# EAGLE design DropBeacon-v1.0.0-Rev-D (EAGLE 6.4)
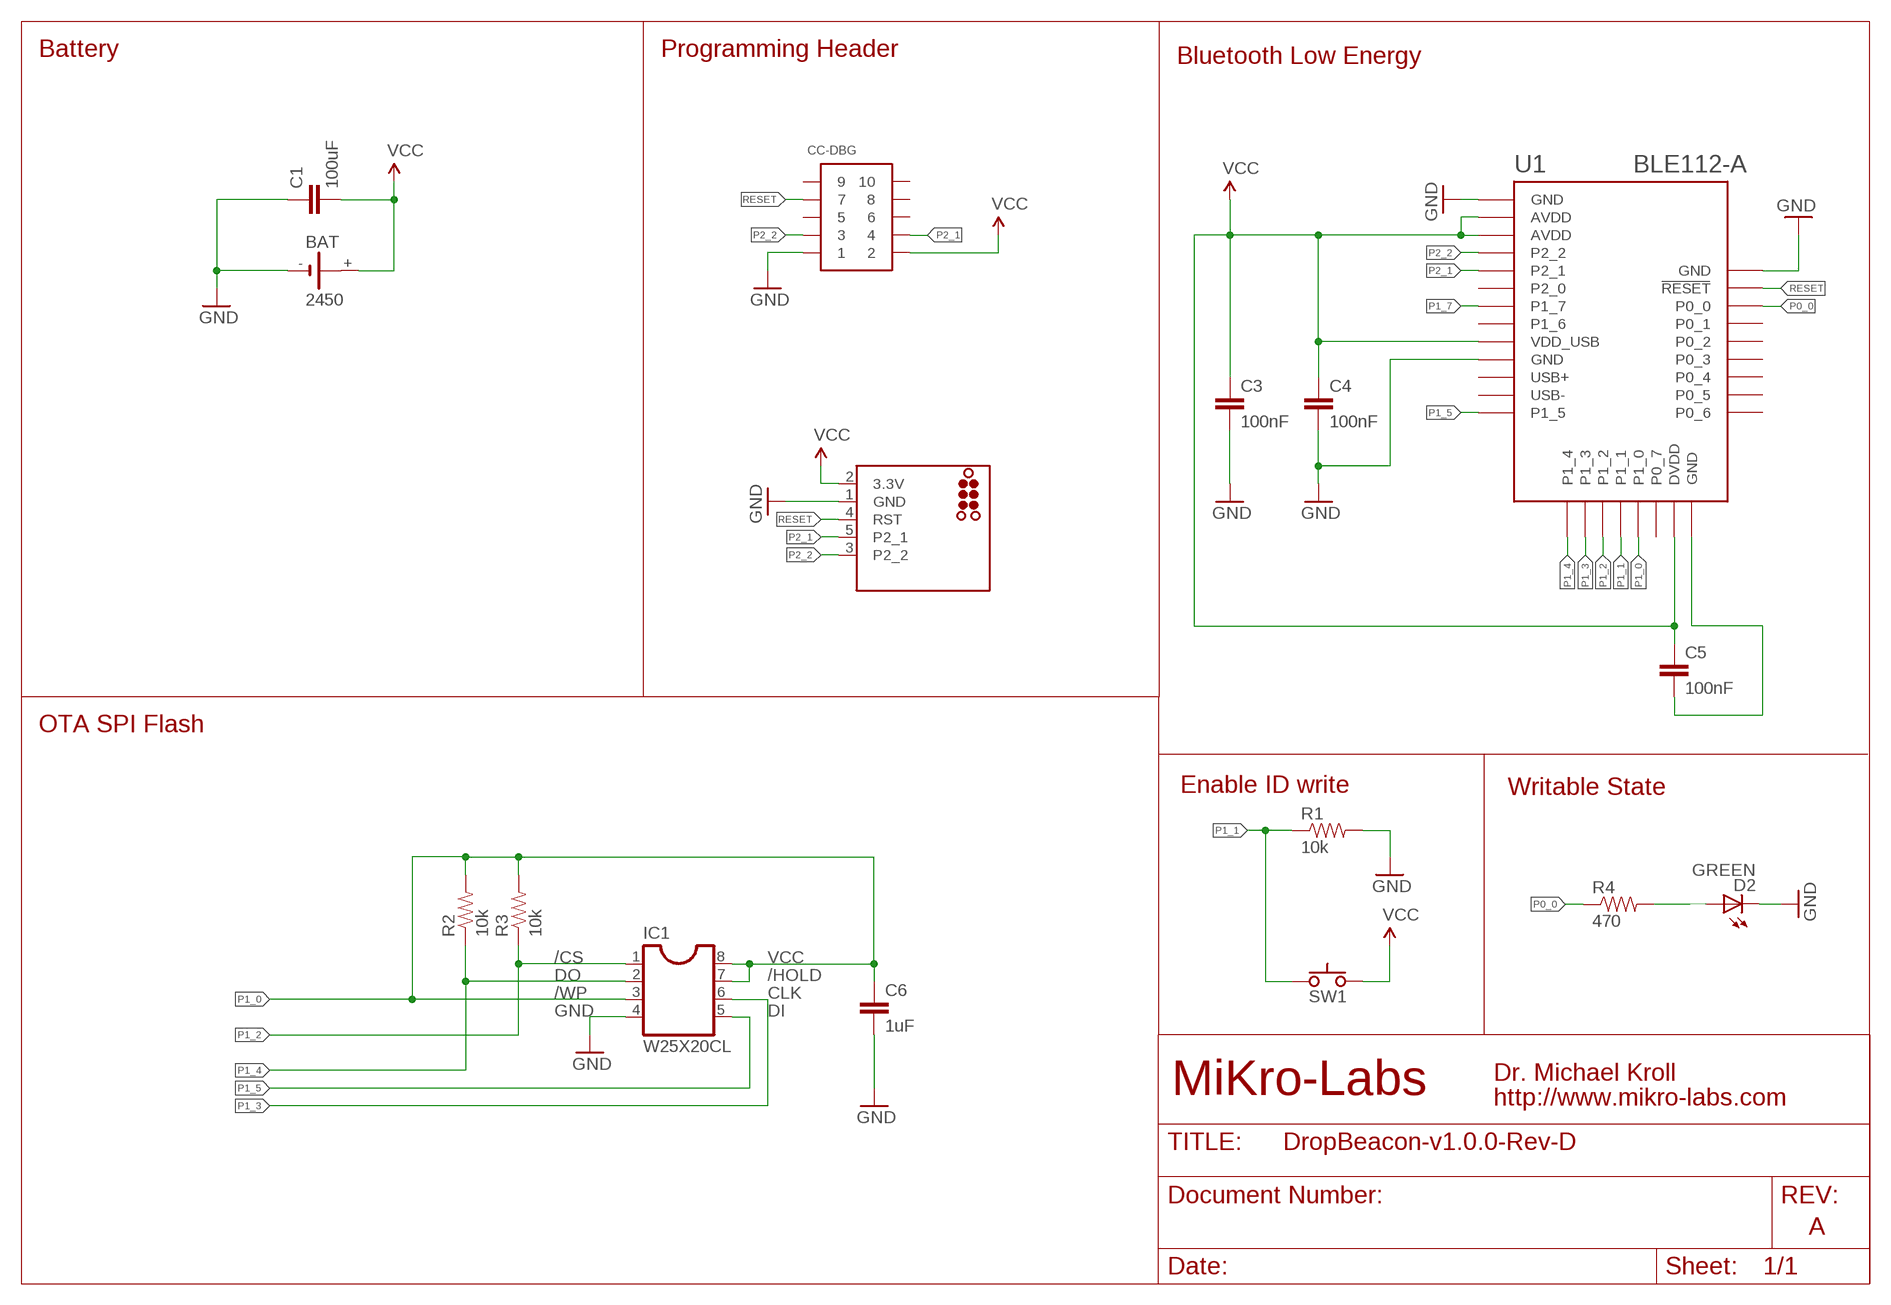
[diagram p0: schematic, sheet 1]

## Parts
BAT  2450  [KZH24SMD]
C1  100uF  CAP1206  [1206]
C3  100nF  CAP0603-CAP  [0603-CAP]
C4  100nF  CAP0603-CAP  [0603-CAP]
C5  100nF  CAP0603-CAP  [0603-CAP]
C6  1uF  CAP0603-CAP  [0603-CAP]
CC-DBG  CONN_5-2-FTSH-V  [FTSH-105-DV]
CC-DEBUGGER  TC2030-CC-DEBUGGER  [TC2030-MCP-NL]
D2  GREEN  LED-GREEN0603  [LED-0603]
IC1  W25X20CL  IC_DIL8-SOIC8  [SO-8]
R1  10k  RESISTOR0603-RES  [0603-RES]
R2  10k  RESISTOR0603-RES  [0603-RES]
R3  10k  RESISTOR0603-RES  [0603-RES]
R4  470  RESISTOR0603-RES  [0603-RES]
SW1  B3U-1000P  [B3U-1000P]
U1  BLE112-A  BLE112-A-VISUAL  [BLE112-A]

## Nets
GND: BAT.- C1.1 C3.2 C4.2 C6.2 CC-DBG.1 CC-DEBUGGER.1(GND) D2.C IC1.4 R1.2 U1.GND U1.GND@2(GND) U1.GND@4(GND)
N$5: D2.A R4.2
N$11: C5.2 U1.GND@3(GND)
P0_0: R4.1 U1.P0_0
P1_0: C6.1 IC1.3 IC1.7 IC1.8 R2.2 R3.2 U1.P1_0
P1_1: R1.1 SW1.1 U1.P1_1
P1_2: IC1.1 R3.1 U1.P1_2
P1_3: IC1.6 U1.P1_3
P1_4: IC1.2 R2.1 U1.P1_4
P1_5: IC1.5 U1.P1_5
P1_7: U1.P1_7
P2_1: CC-DBG.4 CC-DEBUGGER.5(P2_1) U1.P2_1
P2_2: CC-DBG.3 CC-DEBUGGER.3(P2_2) U1.P2_2
RESET: CC-DBG.7 CC-DEBUGGER.4(RST) U1.RESET
VCC: BAT.+ C1.2 C3.1 C4.1 C5.1 CC-DBG.2 CC-DEBUGGER.2(3.3V) SW1.2 U1.AVDD U1.AVDD@2(AVDD) U1.DVDD U1.VDD_USB
Unconnected: CC-DBG.5 CC-DBG.6 CC-DBG.8 CC-DBG.9 CC-DBG.10 U1.P0_1 U1.P0_2 U1.P0_3 U1.P0_4 U1.P0_5 U1.P0_6 U1.P0_7 U1.P1_6 U1.P2_0 U1.USB+ U1.USB-

## Notes on the sheet
- Battery | Programming Header | Bluetooth Low Energy
- OTA SPI Flash
- Enable ID write | Writable State
- /CS | VCC
- DO | /HOLD
- /WP | CLK
- GND | DI
- Dr. Michael Kroll
- MiKro-Labs
- http://www.mikro-labs.com
- A

## Library data of the parts
BAT = SMTU-2032-1:2450
C1 C3-C6 = SparkFun-Capacitors:CAP: Capacitor Standard 0603 ceramic capacitor, and 0.1" leaded capacitor.
CC-DBG = pel_misc:CONN_5-2
CC-DEBUGGER = Tag-Connect:TC2030-CC-DEBUGGER: Arduino TAG-CONNECT ICSP Connector Manufacturer: Tag-Connect <http://www.tag-connect.com> Cable for easy Arduino In-Circuit Bootloader and Sketch Programming. PAD Description 1 MISO 2 VCC 3 SCK 4 MOSI 5 RST 6 GND ©2013 http://www.mkroll.mobi - modified and updated by Dr. Michael Kroll ‹dr.michael.kroll@gmail.com›
D2 = SparkFun-LED:LED-GREEN: Various green LEDs 0603- DIO-00821 LARGE- DIO-00862 LILYPAD- DIO-09910; PROD_ID: DIO-00821
IC1 = dp_devices:IC_DIL8: Universal 8pins IC
R1-R4 = SparkFun-Resistors:RESISTOR: Resistor Basic schematic elements and footprints for 0603, 1206, and PTH resistors.
SW1 = switch-omron:B3U-1000P: Tactile switch Top actuated, without ground terminal, without boss.
U1 = sf-bluegiga:BLE112-A-VISUAL: Bluetooth Low Energy single-mode module - Bluetooth 4.0, chip antenna

## Board
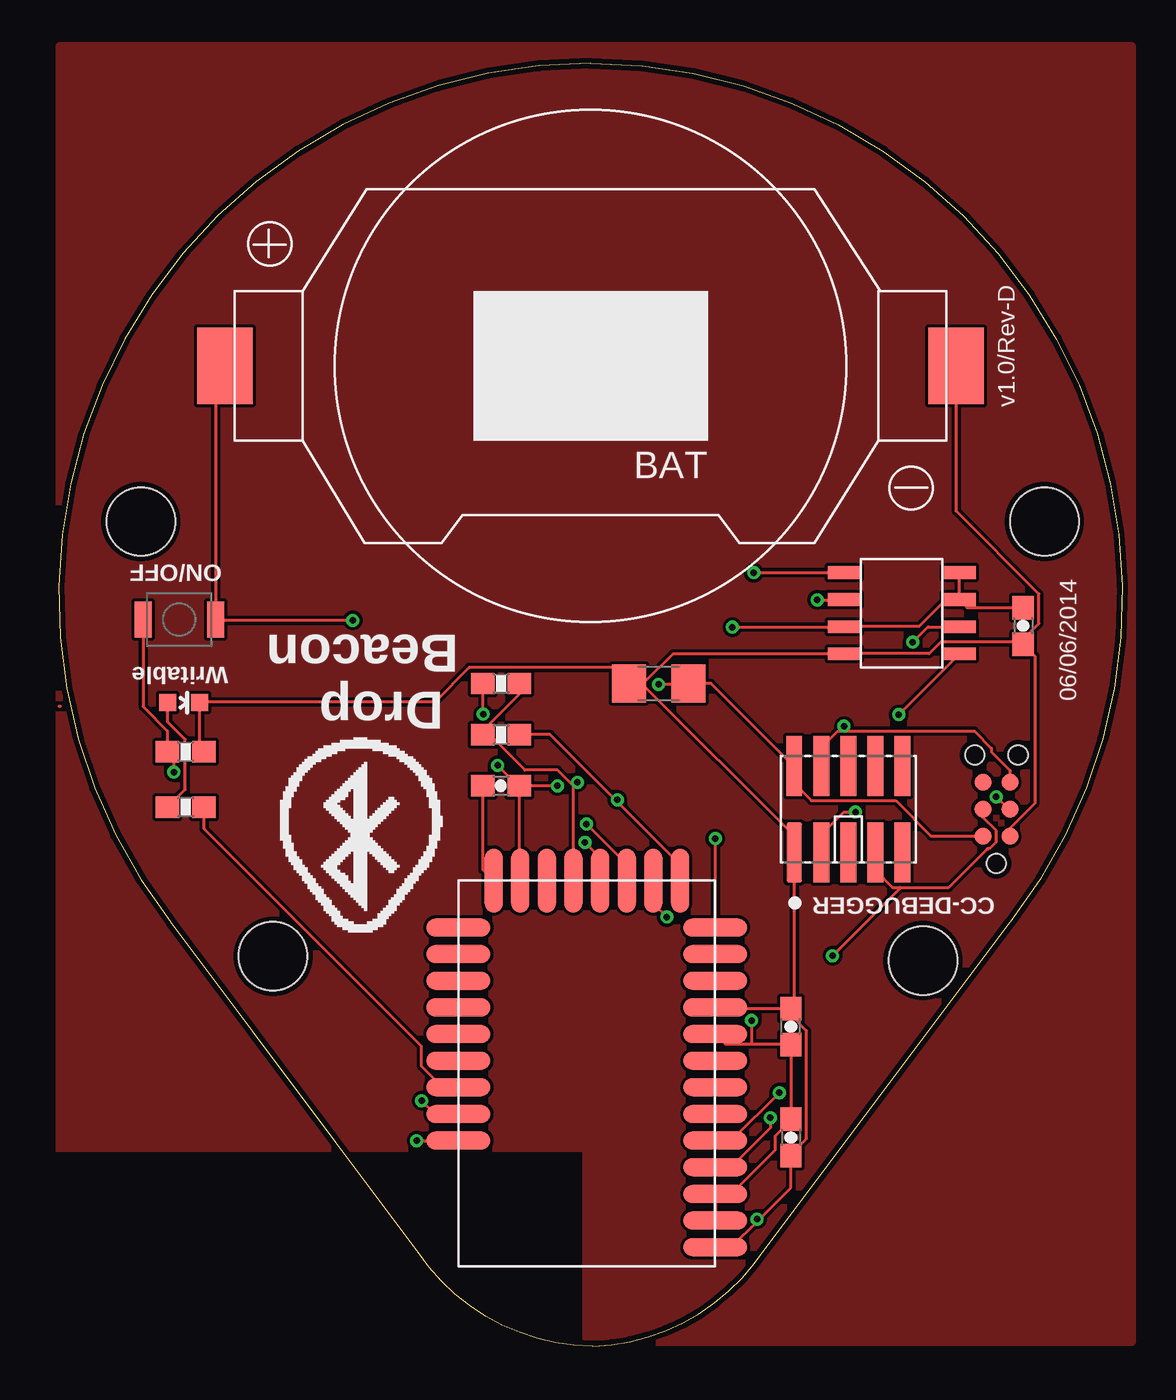
[diagram p1: board, top side]
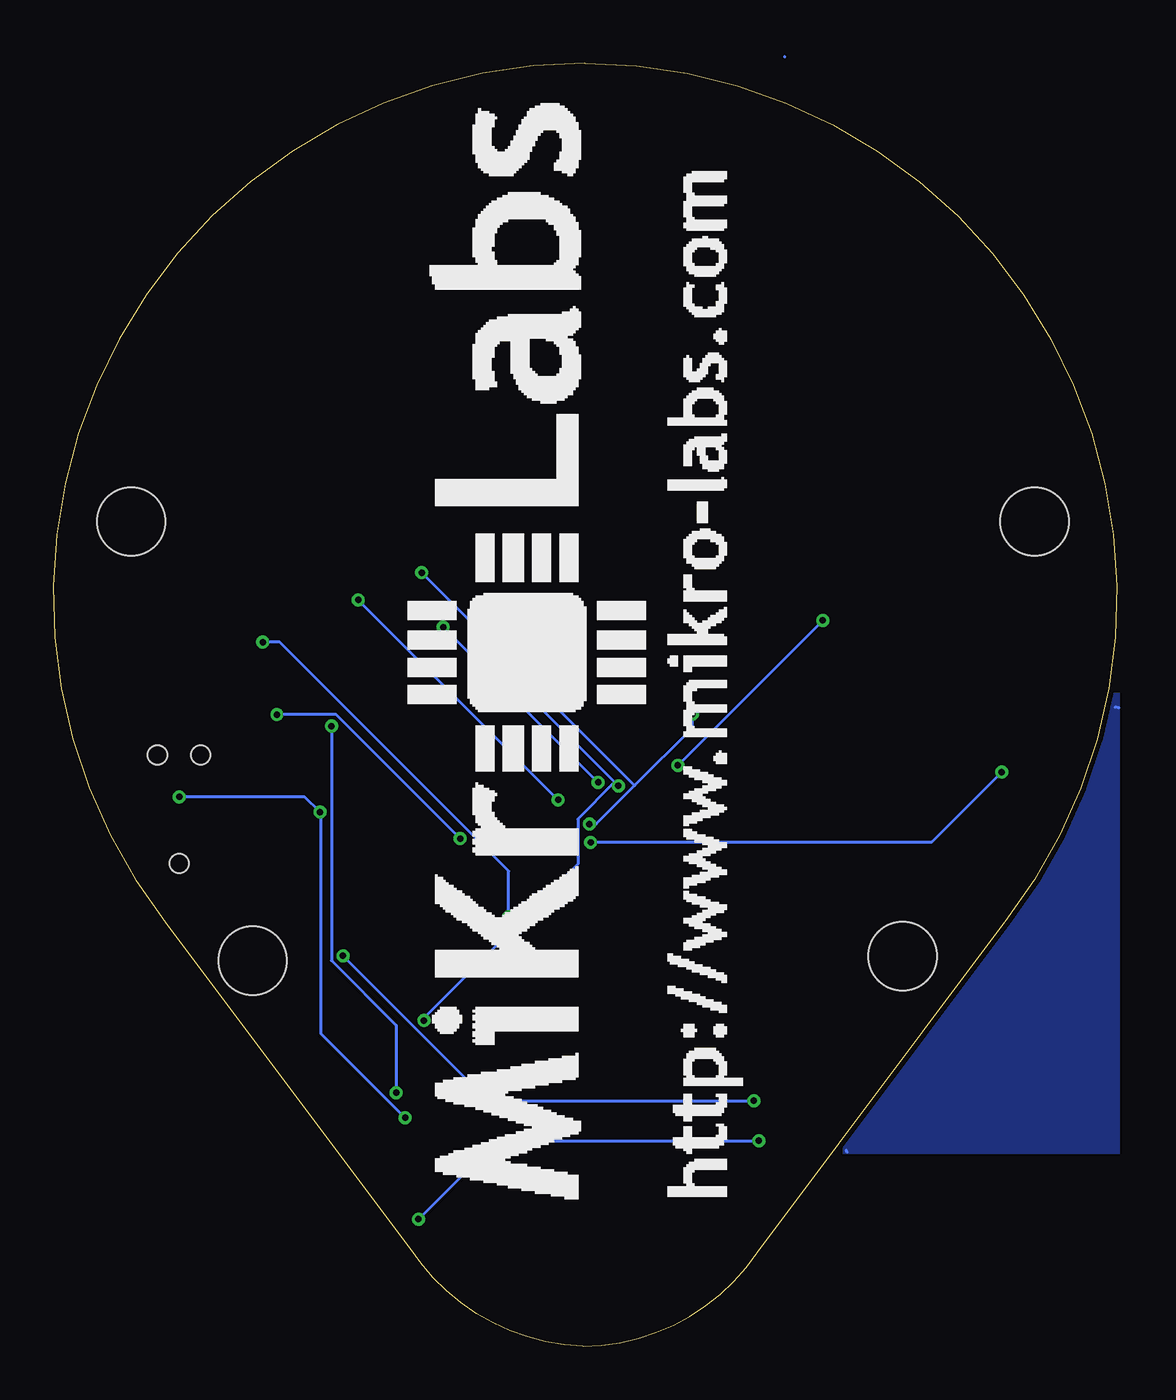
[diagram p2: board, bottom side, seen from below]

Size 49.91 x 60.2 mm. Coordinates in mm from the lower left corner, seen from the top.
Outline: 24.95,60.2 arc128 5.25,19.9 16.85,4.4 arc55 25.05,0 arc55 33.15,4.6 44.65,19.9 arc128 24.95,60.2
Copper layers (1*2*15*16): Top 0.035mm / dielectric 0.2mm / layer 2 0.0175mm / dielectric 1.1mm / layer 15 0.0175mm / dielectric 0.2mm / Bottom 0.035mm
Design rules "SeeedStudio_DRU_no_angle_20130527": minimum track width 6mil, minimum drill 12mil, track to track 6mil, track to pad 6mil, pad to pad 6mil, via to via 6mil, smd to smd 0mil, copper to edge 10mil, drill to drill 10mil, minimum pad ring 6mil, minimum via ring 6mil, stop-mask expansion 2mil, vias tented up to drill 25mil, thermal gap 10mil
Holes 3.2 mm at 46.25,38.7 10.05,18.3 3.85,38.7 40.55,18.1
tRestrict: area 0.1,0.1 to 24.6,9.1
bRestrict: area 0,0.2 to 24.7,9

### Footprints (pad centres in the part's own frame; a part is rotated, then mirrored left to right if it is on the bottom)
KZH24SMD = smd 2.6 x 3.6: + 17.15,0; - -17.15,0
1206 = smd 1.6 x 1.8: 1 -1.4,0; 2 1.4,0
0603-CAP = smd 1.1 x 1: 1 -0.85,0; 2 0.85,0
FTSH-105-DV = smd 0.74 x 2.8: 1 -2.54,-2.03; 2 -2.54,2.03; 3 -1.27,-2.03; 4 -1.27,2.03; 5 0,-2.03; 6 0,2.03; 7 1.27,-2.03; 8 1.27,2.03; 9 2.54,-2.03; 10 2.54,2.03
TC2030-MCP-NL = smd 0.787 x 0.787: 1 1.27,-0.635; 2 1.27,0.635; 3 2.54,-0.635; 4 2.54,0.635; 5 3.81,-0.635; 6 3.81,0.635 | hole 0.889: 0,0; 5.08,-1.016; 5.08,1.016
LED-0603 = smd 0.8 x 0.8: A 0,-0.75; C 0,0.75
SO-8 = smd 0.6 x 1.55: 1 -1.905,-2.69; 2 -0.635,-2.69; 3 0.635,-2.69; 4 1.905,-2.69; 5 1.905,2.71; 6 0.635,2.71; 7 -0.635,2.71; 8 -1.905,2.71
0603-RES = smd 1.1 x 1: 1 -0.85,0; 2 0.85,0
B3U-1000P = smd 0.8 x 1.7: 1 -1.7,0; 2 1.7,0
BLE112-A = smd 3 x 0.85: AVDD -6.05,6.9; AVDD@2 -6.05,5.65; GND -6.05,8.15; GND@2 -6.05,-3.1; GND@4 6,3.15; P0_0 6,0.65; P0_1 6,-0.6; P0_2 6,-1.85; P0_3 6,-3.1; P0_4 6,-4.35; P0_5 6,-5.6; P0_6 6,-6.85; P1_5 -6.05,-6.85; P1_6 -6.05,-0.6; P1_7 -6.05,0.65; P2_0 -6.05,1.9; P2_1 -6.05,3.15; P2_2 -6.05,4.4; RESET 6,1.9; USB+ -6.05,-4.35; USB- -6.05,-5.6; VDD_USB -6.05,-1.85 | smd 0.85 x 3: DVDD 3.1,-9.05; GND@3 4.35,-9.05; P0_7 1.85,-9.05; P1_0 0.6,-9.05; P1_1 -0.65,-9.05; P1_2 -1.9,-9.05; P1_3 -3.15,-9.05; P1_4 -4.4,-9.05

### Placement (x,y rotation side)
BAT  24.95,46 180 top
C1  28.15,31.1 0 top
C3  34.35,15 90 top
C4  34.35,9.8 270 top
C5  20.75,26.3 180 top
C6  45.25,33.8 270 top
CC-DBG  37.05,25.2 0 top
CC-DEBUGGER  44,22.66 90 top
D2  5.85,30.2 270 top
IC1  39.55,34.4 270 top
R1  5.95,27.9 0 top
R2  20.75,28.7 180 top
R3  20.75,31.1 0 top
R4  5.95,25.3 180 top
SW1  5.65,34.1 0 top
U1  24.75,12.8 180 top
U$1  [MIKROLABS-LOGO-LARGE]  20.25,4.3 90 bottom
U$2  [MIKROLABS-URL]  16.45,5.8 90 bottom
U$3  [DROPBEACON-MINI]  17.95,28.5 180 top

### Tracks (layer width: path | path; a pad name or v marks a point on that pad's centre or on a via)
BOTTOM
  Bottom 0.152: 15.59,60.52 15.59,60.5
GND  (via drill 0.3)
  Top 0.152: C3.2 30.85,15.86 U1.GND@2 | C3.2 34.39,15.92 34.51,16.04 CC-DBG.1 34.49,23.24 34.49,23.96 27.37,31.08 C1.1 | 32.82,5.91 31.57,4.66 U1.GND | 32.82,5.91 34.35,7.44 C4.2 34.37,9.02 35.09,9.74 35.09,14.8 34.37,15.52 34.37,15.78 C3.2 | v16.79,9.64 U1.GND@4 | v32.77,5.96 32.82,5.91 | R1.2 6.61,28.08 D2.C 6.67,30.24 17.65,30.24 19.25,31.84 26.01,31.84 C1.1 | CC-DEBUGGER.1 44.65,24.32 45.81,25.48 45.81,32.38 C6.2 | C6.2 45.19,32.98 45.13,33.04 41.39,33.04 40.85,32.5 IC1.4 36.79,32.48 28.81,32.48 27.47,31.14 26.81,31.14 C1.1 | BAT.- 42.11,39.18 45.99,35.3 45.99,33.92 45.17,33.1 C6.2
  Bottom 0.152: v16.79,9.64 29.09,9.64 v32.77,5.96
N$1
  Bottom 0.152: 12.65,9.12 12.69,9.2 | -0.11,29.96 0.08,30
  pour Bottom: 0.05,0.2 50.25,0.2 50.25,60.9 0.05,60.9
N$2
  pour Top: 0.05,0.2 50.35,0.2 50.35,61 0.05,61
N$5
  Top 0.152: D2.A 5.11,29.3 5.93,28.48 5.93,26.12 R4.2
N$11
  Top 0.152: U1.GND@3 19.91,22.34 C5.2
P0_0
  Top 0.152: R4.1 6.81,24.28 17.01,14.08 17.01,13.14 17.99,12.16 U1.P0_0
P1_0  (via drill 0.3)
  Top 0.152: C6.1 42.63,34.66 42.27,35.02 IC1.7 | IC1.7 42.19,35.02 41.61,35.02 40.37,33.78 IC1.3 36.79,33.74 v31.61,33.74 | IC1.8 42.27,35.1 IC1.7 | R3.2 21.59,30.58 19.91,28.9 R2.2 19.97,28.66 20.25,28.66 21.87,27.04 23.41,27.04 24.15,26.3 | U1.P1_0 24.15,26.3 | v24.33,26.46 24.21,26.34 24.15,26.3
  Bottom 0.152: v24.33,26.46 v31.61,33.74
P1_1  (via drill 0.3)
  Top 0.152: SW1.1 3.95,30.02 5.09,28.88 R1.1 5.13,27.84 5.39,27.58 v5.39,26.94 | v24.69,23.64 25.39,22.94 U1.P1_1
  Bottom 0.152: v24.69,23.64 8.69,23.64 v5.39,26.94
P1_2  (via drill 0.3)
  Top 0.152: v19.91,29.66 R3.1 | v24.75,24.5 26.65,22.6 U1.P1_2 | v32.61,36.3 IC1.1
  Bottom 0.152: v19.91,29.66 19.91,29.02 22.62,26.31 | 22.62,26.31 24.43,24.5 v24.75,24.5 | 22.62,26.31 v32.61,36.3
P1_3  (via drill 0.3)
  Top 0.152: v40.07,33.04 40.79,33.76 IC1.6 | v28.53,20.14 27.91,20.76 U1.P1_3
  Bottom 0.152: v40.07,33.04 39.27,33.04 28.53,22.3 v28.53,20.14
P1_4  (via drill 0.3)
  Top 0.152: R2.1 23.05,28.7 26.16,25.59 | 26.16,25.59 29.15,22.6 U1.P1_4 | v35.59,35.02 36.85,35.02 IC1.2 | v26.21,25.64 26.16,25.59
  Bottom 0.152: v26.21,25.64 v35.59,35.02
P1_5  (via drill 0.3)
  Top 0.152: v39.41,29.64 42.25,32.48 IC1.5 | v30.81,23.82 U1.P1_5
  Bottom 0.152: v39.41,29.64 36.63,29.64 v30.81,23.82
P2_1  (via drill 0.3)
  Top 0.152: 36.85,28.86 36.57,28.86 35.79,28.08 CC-DBG.4 | 36.85,28.86 42.97,28.86 43.77,28.06 43.77,27.88 44.63,27.02 CC-DEBUGGER.5 | v33.81,11.9 31.57,9.66 U1.P2_1 | 36.85,28.86 v36.85,29.1
  Bottom 0.152: v33.81,11.9 33.81,15.06 36.85,18.1 v36.85,29.1
P2_2  (via drill 0.3)
  Top 0.152: CC-DEBUGGER.3 44.57,25.2 v43.99,25.78 | v37.39,25.06 36.83,25.06 35.79,24.02 CC-DBG.3 | U1.P2_2 31.55,8.4 33.39,10.24 v33.39,10.72
  Bottom 0.152: v43.99,25.78 38.11,25.78 v37.39,25.06 37.35,25 37.35,14.68 v33.39,10.72
RESET  (via drill 0.3)
  Top 0.152: 39.47,21.54 39.11,21.54 38.33,22.32 CC-DBG.7 | 39.47,21.54 41.77,21.54 43.57,23.34 43.61,23.34 43.63,23.36 43.65,23.36 43.67,23.38 43.71,23.38 43.99,23.66 43.99,24.2 43.37,24.82 CC-DEBUGGER.4 | U1.RESET 17.65,10.9 v17.03,11.52 | v36.31,18.32 39.47,21.48 39.47,21.54
  Bottom 0.152: v17.03,11.52 29.51,11.52 v36.31,18.32
TOP
  Top 0.152: 0.01,30.02 0.07,30.03
VCC  (via drill 0.3)
  Top 0.152: BAT.+ 7.35,45.56 SW1.2 7.41,34.06 v13.79,34.06 | U1.AVDD U1.AVDD@2 30.87,7.18 31.59,7.18 33.61,9.2 33.61,9.86 34.33,10.58 C4.1 C3.1 34.29,14.18 32.51,14.18 | 32.51,14.18 31.27,14.18 U1.VDD_USB | C5.1 21.61,21.9 U1.DVDD | CC-DEBUGGER.2 43.35,23.94 40.93,23.94 39.27,25.6 35.31,25.6 34.51,26.4 CC-DBG.2 34.45,27.26 30.61,31.1 C1.2 29.49,31.06 v28.15,31.06 | v23.39,26.3 C5.1 | v32.51,15.28 32.51,14.18 | v20.59,27.26 21.53,26.32 C5.1
  Bottom 0.152: v28.15,31.06 v23.39,26.3 23.61,26.42 25.29,24.74 25.29,22.62 32.51,15.4 v32.51,15.28 | v20.59,27.26 v13.79,34.06

### Text on the board
tPlace: v1.0/Rev-D | ON/OFF | 06/06/2014 | Drop / Beacon | Writable